# Altium schematic sheet Power.SchDoc: Power
size A4; ApprovedBy: Maduranga Mathara Arachchi; CheckedBy: Maduranga Mathara Arachchi; Author: Maduranga Mathara Arachchi; CompanyName: Maduranga Mathara Arachchi; DrawnBy: Maduranga Mathara Arachchi; Engineer: Maduranga Mathara Arachchi; Organization: Maduranga Mathara Arachchi; Address1: 17/21, Gnanawimala Road,; Address2: Athurugiriya; Address3: Colombo,; Address4: Sri Lanka.; DocumentNumber: 1; Revision: 0.1; SheetNumber: 4; SheetTotal: 7
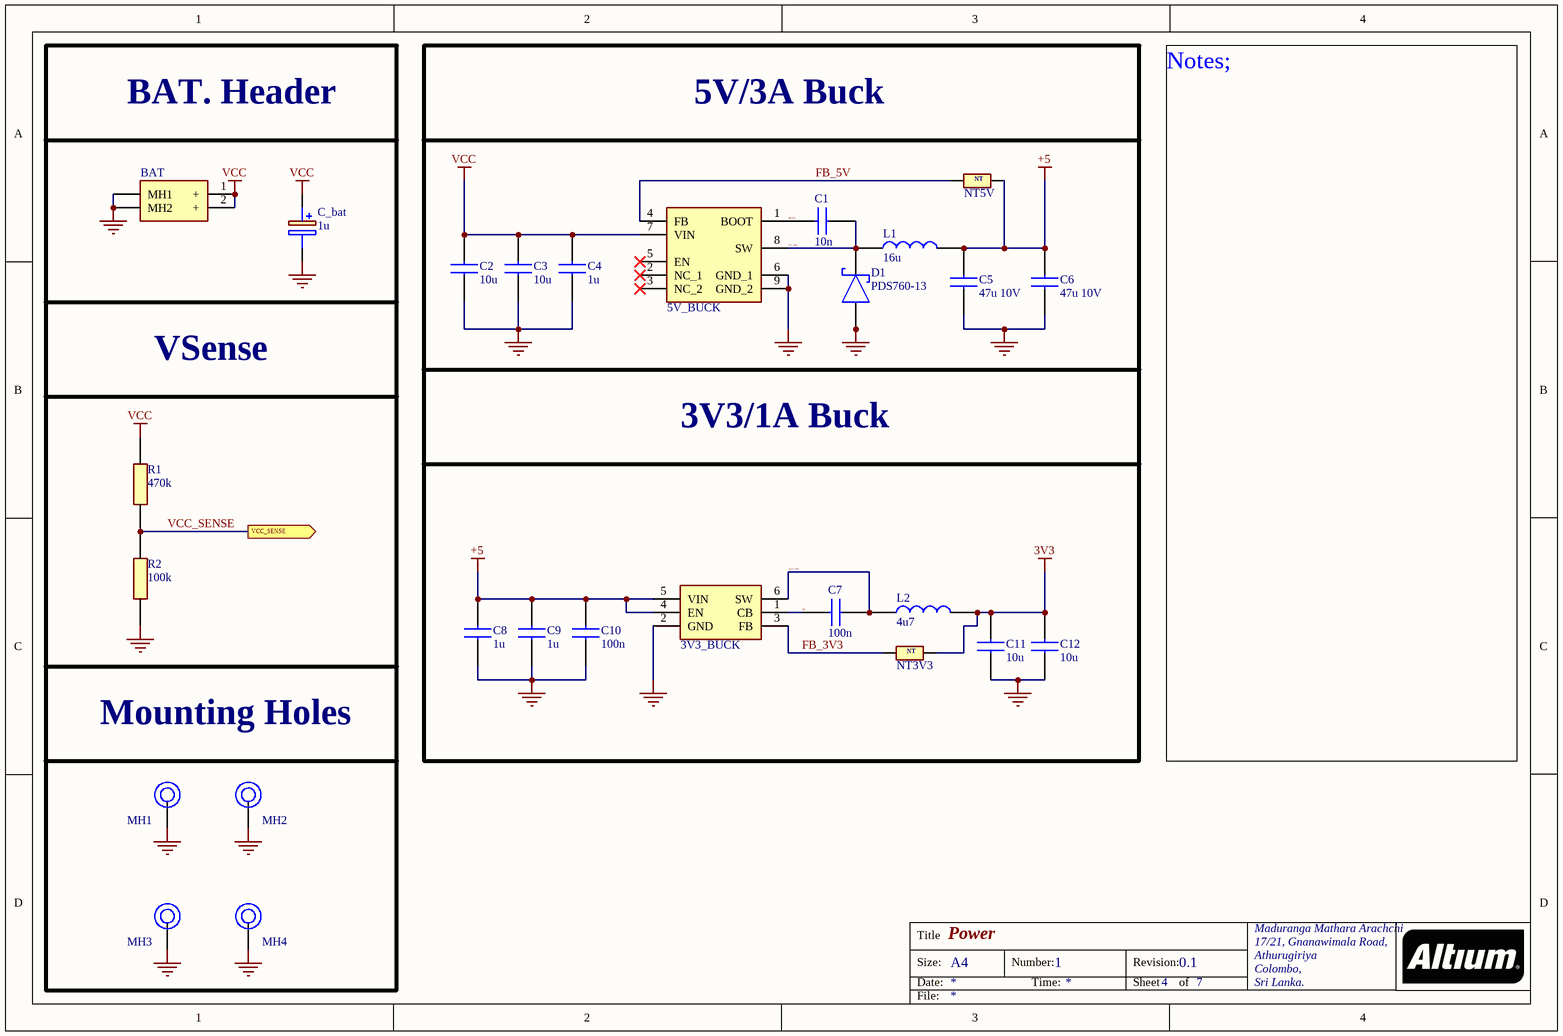
[diagram p0: Power.SchDoc]

## Parts
3V3_BUCK  LMR50410Y3FQDBVRQ1  [SOT95P280X145-6N]  (value not drawn)
5V_BUCK  LM22676QMRX-5.0_NOPB  [SOIC127P600X170-9N]  (value not drawn)
BAT  XT60PW-M  [XT60PWM]  (value not drawn)
C1  10n  [C0603]
C2  10u  [CAPC1608X90N]
C3  10u  [CAPC1608X90N]
C4  1u  [CAPC1608X90N]
C5  47u 10V  [GRM32x]
C6  47u 10V  [GRM32x]
C7  100n  [GRM18x]
C8  1u  [CAPC1608X90N]
C9  1u  [CAPC1608X90N]
C10  100n  [GRM18x]
C11  10u  [CAPC1608X90N]
C12  10u  [CAPC1608X90N]
C_bat  1u  [CAPAE430X550N]
D1  PDS760-13  [PDS76013]
L1  16u  [WE-HCI_105023]
L2  4u7  [SDR0403]
MH1  Mounting Hole 2mm  [Mounting Hole]  (value not drawn)  (no BOM)
MH2  Mounting Hole 2mm  [Mounting Hole]  (value not drawn)  (no BOM)
MH3  Mounting Hole 2mm  [Mounting Hole]  (value not drawn)  (no BOM)
MH4  Mounting Hole 2mm  [Mounting Hole]  (value not drawn)  (no BOM)
NT3V3  NetTie_SMD  [NetTie_SMD]  (value not drawn)  (net tie, no BOM)
NT5V  NetTie_SMD  [NetTie_SMD]  (value not drawn)  (net tie, no BOM)
R1  470k  [ERJP03_PA3_(0603)]
R2  100k  [ERJP03_PA3_(0603)]

## Ports
VCC_SENSE (out)

## Nets
3V3: C11.2 C12.2 L2.2 NT3V3.2
+5: 3V3_BUCK.4(EN) 3V3_BUCK.5(VIN) C5.2 C6.2 C8.2 C9.2 C10.2 L1.2 NT5V.2
GND: 3V3_BUCK.2(GND) 5V_BUCK.6(GND_1) 5V_BUCK.9(GND_2) BAT.MH1 BAT.MH2 C2.1 C3.1 C4.1 C5.1 C6.1 C8.1 C9.1 C10.1 C11.1 C12.1 C_bat.2(-) D1.1(A_1) D1.2(A_2) MH1.1 MH2.1 MH3.1 MH4.1 R2.2
VCC: 5V_BUCK.7(VIN) BAT.1(+) BAT.2(+) C2.2 C3.2 C4.2 C_bat.1(+) R1.1
3V3_SW: 3V3_BUCK.6(SW) C7.2 L2.1
5V_SW: 5V_BUCK.8(SW) C1.2 D1.3(COM_K) L1.1
BOOT: 5V_BUCK.1(BOOT) C1.1
CB: 3V3_BUCK.1(CB) C7.1
FB_3V3: 3V3_BUCK.3(FB) NT3V3.1
FB_5V: 5V_BUCK.4(FB) NT5V.1
VCC_SENSE: R1.2 R2.1 ; port VCC_SENSE

Not connected (* = marked no-connect by the designer): 5V_BUCK 2(NC_1)* 3(NC_2)* 5(EN)*

## Notes on the sheet
- BAT. Header
- 5V/3A Buck
- VSense
- 3V3/1A Buck
- Mounting Holes
- Notes;
- Title
- Size:
- Date:
- A4
- Number:
- Time:
- Revision:
- Sheet
- of
- File:
- (in symbol NetTie_SMD) NT

## Library data of the parts
3V3_BUCK = LMR50410Y3FQDBVRQ1: 3V3 Buck; Manufacturer_Name: Texas Instruments; Datasheet Link: https://www.ti.com/lit/ds/symlink/lmr50410-q1.pdf?ts=1611309677669; Height: 1.45mm; Manufacturer_Part_Number: LMR50410Y3FQDBVRQ1; Mouser Part Number: 595-R50410Y3FQDBVRQ1; Mouser Price/Stock: https://www.mouser.co.uk/ProductDetail/Texas-Instruments/LMR50410Y3FQDBVRQ1?qs=81r%252BiQLm7BTaIXwCgdOuiA%3D%3D; Arrow Part Number: LMR50410Y3FQDBVRQ1; Arrow Price/Stock: https://www.arrow.com/en/products/lmr50410y3fqdbvrq1/texas-instruments?utm_currency=USD&region=europe
5V_BUCK = LM22676QMRX-5.0_NOPB: 5V Buck; Manufacturer_Name: Texas Instruments; Manufacturer_Part_Number: LM22676QMRX-5.0/NOPB; Datasheet Link: https://www.ti.com/general/docs/suppproductinfo.tsp?distId=10&gotoUrl=https%3A%2F%2Fwww.ti.com%2Flit%2Fgpn%2Flm22676; Height: 1.7mm; Mouser Part Number: 926-LM22676QMRX50NPB; Mouser Price/Stock: https://www.mouser.com/Search/Refine.aspx?Keyword=926-LM22676QMRX50NPB
BAT = XT60PW-M: Power Header; Manufacturer_Name: Changzhou Amass Elec; Datasheet Link: https://www.tme.eu/Document/b13629717d44ae038681dba08d18c0b6/XT60PW-M.pdf; Height: 8.4mm; Manufacturer_Part_Number: XT60PW-M
C1 = C0603C103K5RACTU: Capacitor; Manufacturer_Name: KEMET; Datasheet Link: https://content.kemet.com/datasheets/KEM_C1002_X7R_SMD.pdf; Height: 0.87mm; Manufacturer_Part_Number: C0603C103K5RACTU; Mouser Part Number: 80-C0603C103K5R; Mouser Price/Stock: https://www.mouser.co.uk/ProductDetail/KEMET/C0603C103K5RACTU?qs=aZBT8IJKz4hu1X55tMAU6Q%3D%3D; Arrow Part Number: C0603C103K5RACTU; Arrow Price/Stock: https://www.arrow.com/en/products/c0603c103k5ractu/kemet-corporation?utm_currency=USD&region=nac
C2 C3 C11 C12 = C0603C106M9PAC-TU: Capacitor; Manufacturer_Name: KEMET; Datasheet Link: https://componentsearchengine.com/Datasheets/2/C0603C106M9PAC-TU.pdf; Height: 0.9mm; Manufacturer_Part_Number: C0603C106M9PAC-TU
C4 C8 C9 = MSASU168SB5105KTNA01: Capacitor; Manufacturer_Name: TAIYO YUDEN; Datasheet Link: https://ds.yuden.co.jp/TYCOMPAS/or/detail?pn=MSASU168SB5105KTNA01&u=M; Height: 0.9mm; Manufacturer_Part_Number: MSASU168SB5105KTNA01; Mouser Part Number: 963-MSASU168SB5105KT; Mouser Price/Stock: https://www.mouser.co.uk/ProductDetail/TAIYO-YUDEN/MSASU168SB5105KTNA01?qs=tlsG%2FOw5FFjgZgcWjqLW4Q%3D%3D; Arrow Part Number: MSASU168SB5105KTNA01; Arrow Price/Stock: https://www.arrow.com/en/products/msasu168sb5105ktna01/taiyo-yuden?region=nac
C5 C6 = GRM32ER71A476KE15L: Capacitor; Manufacturer_Name: Murata Electronics; Datasheet Link: https://search.murata.co.jp/Ceramy/image/img/A01X/G101/ENG/GRM32ER71A476KE15-04CA.pdf; Height: 1.5mm; Manufacturer_Part_Number: GRM32ER71A476KE15L; Mouser Part Number: 81-GRM32ER71A476KE5L; Mouser Price/Stock: https://www.mouser.co.uk/ProductDetail/Murata-Electronics/GRM32ER71A476KE15L?qs=igOKQWwJTmw3%252BdJ0z0AeYw%3D%3D; Arrow Part Number: GRM32ER71A476KE15L; Arrow Price/Stock: https://www.arrow.com/en/products/grm32er71a476ke15l/murata-manufacturing?utm_currency=USD&region=nac
C7 C10 = GRM188R72A104KA35D: Capacitor; Manufacturer_Name: Murata Electronics; Datasheet Link: https://search.murata.co.jp/Ceramy/image/img/A01X/G101/ENG/GRM188R72A104KA35-01A.pdf; Height: 0.9mm; Manufacturer_Part_Number: GRM188R72A104KA35D; Mouser Part Number: 81-GRM188R72A104KA35; Mouser Price/Stock: https://www.mouser.co.uk/ProductDetail/Murata-Electronics/GRM188R72A104KA35D?qs=P%252BBA3F6RM%2F5aaC9LFKRzYw%3D%3D; Arrow Part Number: GRM188R72A104KA35D; Arrow Price/Stock: https://www.arrow.com/en/products/grm188r72a104ka35d/murata-manufacturing?utm_currency=USD&region=nac
C_bat = 865081740001: Capacitor Polarised; Manufacturer_Name: Wurth Elektronik; Datasheet Link: https://www.we-online.com/components/products/datasheet/865081740001.pdf; Height: 5.5mm; Manufacturer_Part_Number: 865081740001; Mouser Part Number: 710-865081740001; Mouser Price/Stock: https://www.mouser.co.uk/ProductDetail/Wurth-Elektronik/865081740001?qs=amGC7iS6iy8gfpWwzj%2FS%2Fg%3D%3D
D1 = PDS760-13: Schottky Diode; Manufacturer_Name: Diodes Incorporated; Datasheet Link: https://www.diodes.com/assets/Datasheets/PDS760.pdf; Height: 1.15mm; Manufacturer_Part_Number: PDS760-13; Mouser Part Number: 621-PDS760-F; Mouser Price/Stock: https://www.mouser.co.uk/ProductDetail/Diodes-Incorporated/PDS760-13?qs=%2FNF5U5UGuWlxwy7NIrHVWQ%3D%3D; Arrow Part Number: PDS760-13; Arrow Price/Stock: https://www.arrow.com/en/products/pds760-13/diodes-incorporated?region=europe
L1 = 7443251600: Inductor; Manufacturer_Name: Wurth Elektronik; Manufacturer_Part_Number: 7443251600; Mouser Part Number: 710-7443251600; Mouser Price/Stock: https://www.mouser.co.uk/ProductDetail/Wurth-Elektronik/7443251600?qs=VxkwJfKV0FSkbbPOgC7FsA%3D%3D
L2 = SDR0403-4R7ML: Inductor; Manufacturer_Name: Bourns; Datasheet Link: http://www.bourns.com/docs/Product-Datasheets/sdr0403.pdf; Manufacturer_Part_Number: SDR0403-4R7ML; Mouser Part Number: 652-SDR0403-4R7ML; Mouser Price/Stock: https://www.mouser.co.uk/ProductDetail/Bourns/SDR0403-4R7ML?qs=xrpI9KL%2FXvtm2g7dmggyxA%3D%3D; Arrow Part Number: SDR0403-4R7ML; Arrow Price/Stock: https://www.arrow.com/en/products/sdr0403-4r7ml/bourns?region=nac
R1 = ERJ-PA3F4703V: Resistor; Manufacturer_Name: Panasonic; Datasheet Link: https://industrial.panasonic.com/cdbs/www-data/pdf/RDO0000/AOA0000C331.pdf; Height: 0.55mm; Manufacturer_Part_Number: ERJ-PA3F4703V; Mouser Part Number: 667-ERJ-PA3F4703V; Mouser Price/Stock: https://www.mouser.co.uk/ProductDetail/Panasonic/ERJ-PA3F4703V?qs=BzJM0faLVqUgOOiMN4LfmA%3D%3D
R2 = ERJ-PA3F1003V: Resistor; Manufacturer_Name: Panasonic; Datasheet Link: https://industrial.panasonic.com/cdbs/www-data/pdf/RDO0000/AOA0000C331.pdf; Height: 0.55mm; Manufacturer_Part_Number: ERJ-PA3F1003V; Mouser Part Number: 667-ERJ-PA3F1003V; Mouser Price/Stock: https://www.mouser.co.uk/ProductDetail/Panasonic/ERJ-PA3F1003V/?qs=T0XSgvH75d5hvtv%252BnTMv1g%3D%3D